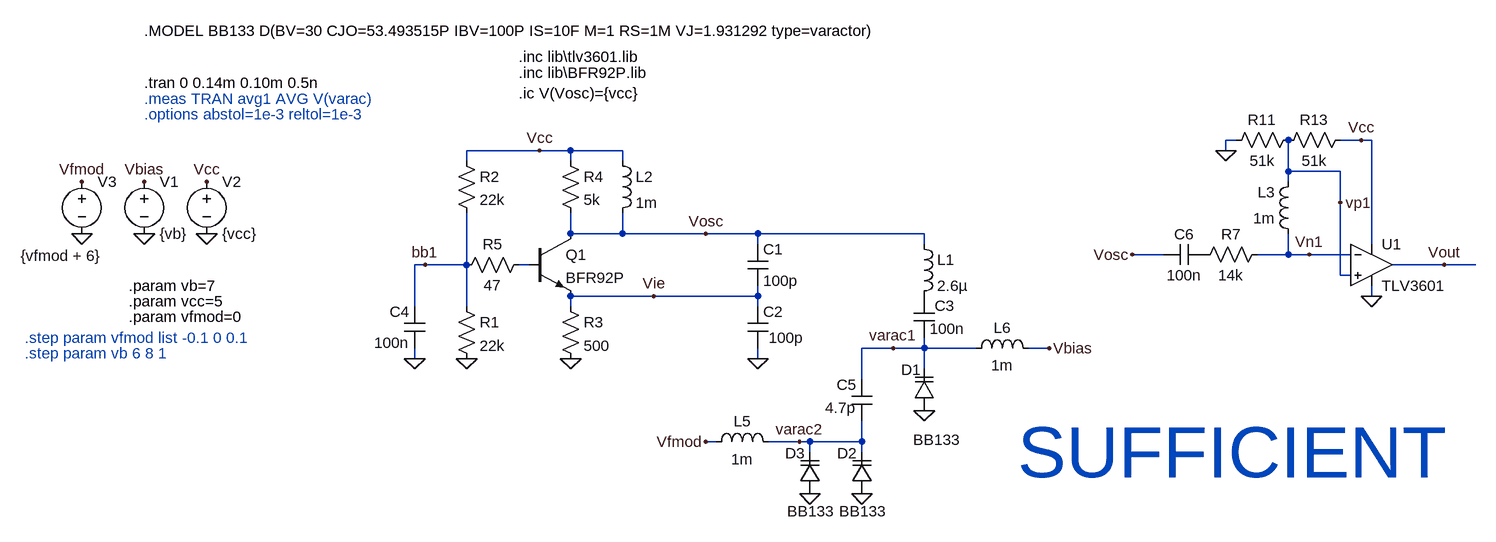
[diagram p0: schematic IF_VCO_module.asc]
IF_VCO_module.asc, the LTspice schematic file:
Version 4.1
SHEET 1 2860 700
WIRE 1888 -128 1872 -128
WIRE 2080 -128 2048 -128
WIRE 2096 -128 2080 -128
WIRE 816 -112 704 -112
WIRE 864 -112 816 -112
WIRE 944 -112 864 -112
WIRE 1872 -112 1872 -128
WIRE 704 -96 704 -112
WIRE 864 -96 864 -112
WIRE 944 -96 944 -112
WIRE 1968 -80 1968 -128
WIRE 2048 -80 1968 -80
WIRE 1968 -64 1968 -80
WIRE 2048 -32 2048 -80
WIRE 864 16 864 -16
WIRE 944 16 944 -16
WIRE 944 16 864 16
WIRE 1072 16 944 16
WIRE 1152 16 1072 16
WIRE 1408 16 1152 16
WIRE 1152 32 1152 16
WIRE 1408 32 1408 16
WIRE 2096 32 2096 -128
WIRE 1776 48 1728 48
WIRE 1968 48 1968 16
WIRE 1968 48 1920 48
WIRE 2000 48 1968 48
WIRE 2064 48 2000 48
WIRE 640 64 624 64
WIRE 704 64 704 -16
WIRE 704 64 640 64
WIRE 800 64 784 64
WIRE 2208 64 2128 64
WIRE 2256 64 2208 64
WIRE 2048 80 2048 -32
WIRE 2064 80 2048 80
WIRE 992 112 864 112
WIRE 1152 112 1152 96
WIRE 1152 112 992 112
WIRE 2096 112 2096 96
WIRE 624 128 624 64
WIRE 704 128 704 64
WIRE 864 128 864 112
WIRE 1152 128 1152 112
WIRE 1360 192 1312 192
WIRE 1408 192 1408 176
WIRE 1408 192 1360 192
WIRE 1488 192 1408 192
WIRE 1600 192 1568 192
WIRE 624 208 624 192
WIRE 1152 208 1152 192
WIRE 1408 224 1408 192
WIRE 1312 240 1312 192
WIRE 1088 336 1072 336
WIRE 1216 336 1168 336
WIRE 1232 336 1216 336
WIRE 1312 336 1312 304
WIRE 1312 336 1232 336
WIRE 1232 352 1232 336
WIRE 1312 352 1312 336
FLAG 208 16 0
FLAG 304 16 0
FLAG 304 -64 Vcc
FLAG 208 -64 Vbias
FLAG 704 208 0
FLAG 624 208 0
FLAG 816 -112 Vcc
FLAG 864 208 0
FLAG 640 64 bb1
FLAG 2208 64 Vout
FLAG 2096 112 0
FLAG 1872 -112 0
FLAG 1728 48 Vosc
FLAG 2000 48 Vn1
FLAG 2080 -128 Vcc
FLAG 1072 16 Vosc
FLAG 1152 208 0
FLAG 1600 192 Vbias
FLAG 1408 288 0
FLAG 1360 192 varac1
FLAG 1312 416 0
FLAG 1072 336 Vfmod
FLAG 1216 336 varac2
FLAG 1232 416 0
FLAG 992 112 Vie
FLAG 112 16 0
FLAG 112 -64 Vfmod
FLAG 2048 -32 vp1
DATAFLAG 1296 16 ""
SYMBOL npn 800 16 R0
SYMATTR InstName Q1
SYMATTR Value BFR92P
SYMATTR Prefix X
SYMBOL voltage 208 -80 R0
WINDOW 123 0 0 Left 0
WINDOW 39 0 0 Left 0
SYMATTR InstName V1
SYMATTR Value {vb}
SYMBOL voltage 304 -80 R0
WINDOW 123 0 0 Left 0
WINDOW 39 40 66 Left 2
SYMATTR InstName V2
SYMATTR Value {vcc}
SYMBOL ind 928 -112 R0
SYMATTR InstName L2
SYMATTR Value 1m
SYMATTR SpiceLine Rser=10
SYMBOL res 688 112 R0
SYMATTR InstName R1
SYMATTR Value 22k
SYMBOL res 688 -112 R0
SYMATTR InstName R2
SYMATTR Value 22k
SYMBOL res 848 112 R0
SYMATTR InstName R3
SYMATTR Value 500
SYMBOL cap 640 192 R180
WINDOW 0 24 56 Left 2
WINDOW 3 24 8 Left 2
SYMATTR InstName C4
SYMATTR Value 100n
SYMBOL res 800 48 R90
WINDOW 0 0 56 VBottom 2
WINDOW 3 32 56 VTop 2
SYMATTR InstName R5
SYMATTR Value 47
SYMBOL cap 1840 32 R90
WINDOW 0 0 32 VBottom 2
WINDOW 3 32 32 VTop 2
SYMATTR InstName C6
SYMATTR Value 100n
SYMBOL res 1936 32 R90
WINDOW 0 0 56 VBottom 2
WINDOW 3 32 56 VTop 2
SYMATTR InstName R7
SYMATTR Value 14k
SYMBOL res 1984 -144 R90
WINDOW 0 0 56 VBottom 2
WINDOW 3 32 56 VTop 2
SYMATTR InstName R11
SYMATTR Value 51k
SYMBOL OpAmps\\opamp2 2096 0 R0
SYMATTR InstName U1
SYMATTR Value TLV3601
SYMBOL res 2064 -144 R90
WINDOW 0 0 56 VBottom 2
WINDOW 3 32 56 VTop 2
SYMATTR InstName R13
SYMATTR Value 51k
SYMBOL varactor 1424 288 R180
WINDOW 0 21 63 Left 2
WINDOW 3 -39 -45 Left 2
SYMATTR InstName D1
SYMATTR Value BB133
SYMBOL cap 1136 32 R0
SYMATTR InstName C1
SYMATTR Value 100p
SYMBOL cap 1136 128 R0
WINDOW 3 33 48 Left 2
SYMATTR Value 100p
SYMATTR InstName C2
SYMBOL cap 1392 176 M180
WINDOW 0 32 49 Left 2
WINDOW 3 24 14 Left 2
SYMATTR InstName C3
SYMATTR Value 100n
SYMBOL ind 1392 16 R0
SYMATTR InstName L1
SYMATTR Value 2.6µ
SYMBOL cap 1328 304 R180
WINDOW 0 24 56 Left 2
WINDOW 3 25 20 Left 2
SYMATTR InstName C5
SYMATTR Value 4.7p
SYMBOL varactor 1296 416 M180
WINDOW 0 -22 62 Left 2
WINDOW 3 -19 -27 Left 2
SYMATTR InstName D2
SYMATTR Value BB133
SYMBOL ind 1072 352 R270
WINDOW 0 32 56 VTop 2
WINDOW 3 5 56 VBottom 2
SYMATTR InstName L5
SYMATTR Value 1m
SYMATTR SpiceLine Rser=10
SYMBOL ind 1472 208 R270
WINDOW 0 32 56 VTop 2
WINDOW 3 5 56 VBottom 2
SYMATTR InstName L6
SYMATTR Value 1m
SYMATTR SpiceLine Rser=10
SYMBOL varactor 1216 416 M180
WINDOW 0 -22 62 Left 2
WINDOW 3 -19 -27 Left 2
SYMATTR InstName D3
SYMATTR Value BB133
SYMBOL voltage 112 -80 R0
WINDOW 3 -94 130 Left 2
SYMATTR Value {vfmod + 6}
SYMATTR InstName V3
SYMBOL res 848 -112 R0
SYMATTR InstName R4
SYMATTR Value 5k
SYMBOL ind 1984 32 R180
WINDOW 0 36 80 Left 2
WINDOW 3 36 40 Left 2
SYMATTR InstName L3
SYMATTR Value 1m
SYMATTR SpiceLine Rser=10
TEXT 24 200 Left 2 ;.step param vb 6 8 1
TEXT 208 -192 Left 2 ;.meas TRAN avg1 AVG V(varac)
TEXT 184 96 Left 2 !.param vb=7
TEXT 208 -168 Left 2 ;.options abstol=1e-3 reltol=1e-3
TEXT 784 -232 Left 2 !.inc lib\\BFR92P.lib
TEXT 208 -216 Left 2 !.tran 0 0.14m 0.10m 0.5n
TEXT 784 -200 Left 2 !.ic V(Vosc)={vcc}
TEXT 184 120 Left 2 !.param vcc=5
TEXT 208 -296 Left 2 !.MODEL BB133 D(BV=30 CJO=53.493515P IBV=100P IS=10F M=1 RS=1M VJ=1.931292 type=varactor)
TEXT 784 -256 Left 2 !.inc lib\\tlv3601.lib
TEXT 184 144 Left 2 !.param vfmod=0
TEXT 24 176 Left 2 ;.step param vfmod list -0.1 0 0.1
TEXT 1552 352 Left 7 ;SUFFICIENT

The netlist it stands for:
* IF_VCO_module.asc
X§Q1 Vosc N001 Vie BFR92P  ; pins C B E
V1 Vbias 0 {vb}
V2 Vcc 0 {vcc}
L2 Vcc Vosc 1m Rser=10
R1 bb1 0 22k
R2 Vcc bb1 22k
R3 Vie 0 500
C4 0 bb1 100n
R5 N001 bb1 47
C6 P001 Vosc 100n
R7 Vn1 P001 14k
R11 vp1 0 51k
X§U1 vp1 Vn1 Vcc 0 Vout TLV3601  ; pins In+ In- V+ V- OUT
R13 Vcc vp1 51k
D1 0 varac1 BB133
C1 Vosc Vie 100p
C2 Vie 0 100p
C3 varac1 P002 100n
L1 Vosc P002 2.6µ
C5 varac2 varac1 4.7p
D2 0 varac2 BB133
L5 Vfmod varac2 1m Rser=10
L6 varac1 Vbias 1m Rser=10
D3 0 varac2 BB133
V3 Vfmod 0 {vfmod + 6}
R4 Vcc Vosc 5k
L3 Vn1 vp1 1m Rser=10
.model D D
.lib standard.dio
* .step param vb 6 8 1
* .meas TRAN avg1 AVG V(varac)
.param vb=7
* .options abstol=1e-3 reltol=1e-3
.inc lib\BFR92P.lib
.tran 0 0.14m 0.10m 0.5n
.ic V(Vosc)={vcc}
.param vcc=5
.MODEL BB133 D(BV=30 CJO=53.493515P IBV=100P IS=10F M=1 RS=1M VJ=1.931292 type=varactor)
.inc lib\tlv3601.lib
.param vfmod=0
* .step param vfmod list -0.1 0 0.1
* SUFFICIENT
.backanno
.end